# EAGLE schematic Schematic_v29 (EAGLE 9.7.0)
AUTHOR: Luca Brenner; GIT: github.com/BrennerLu/Milwaukee-2-CigLighter
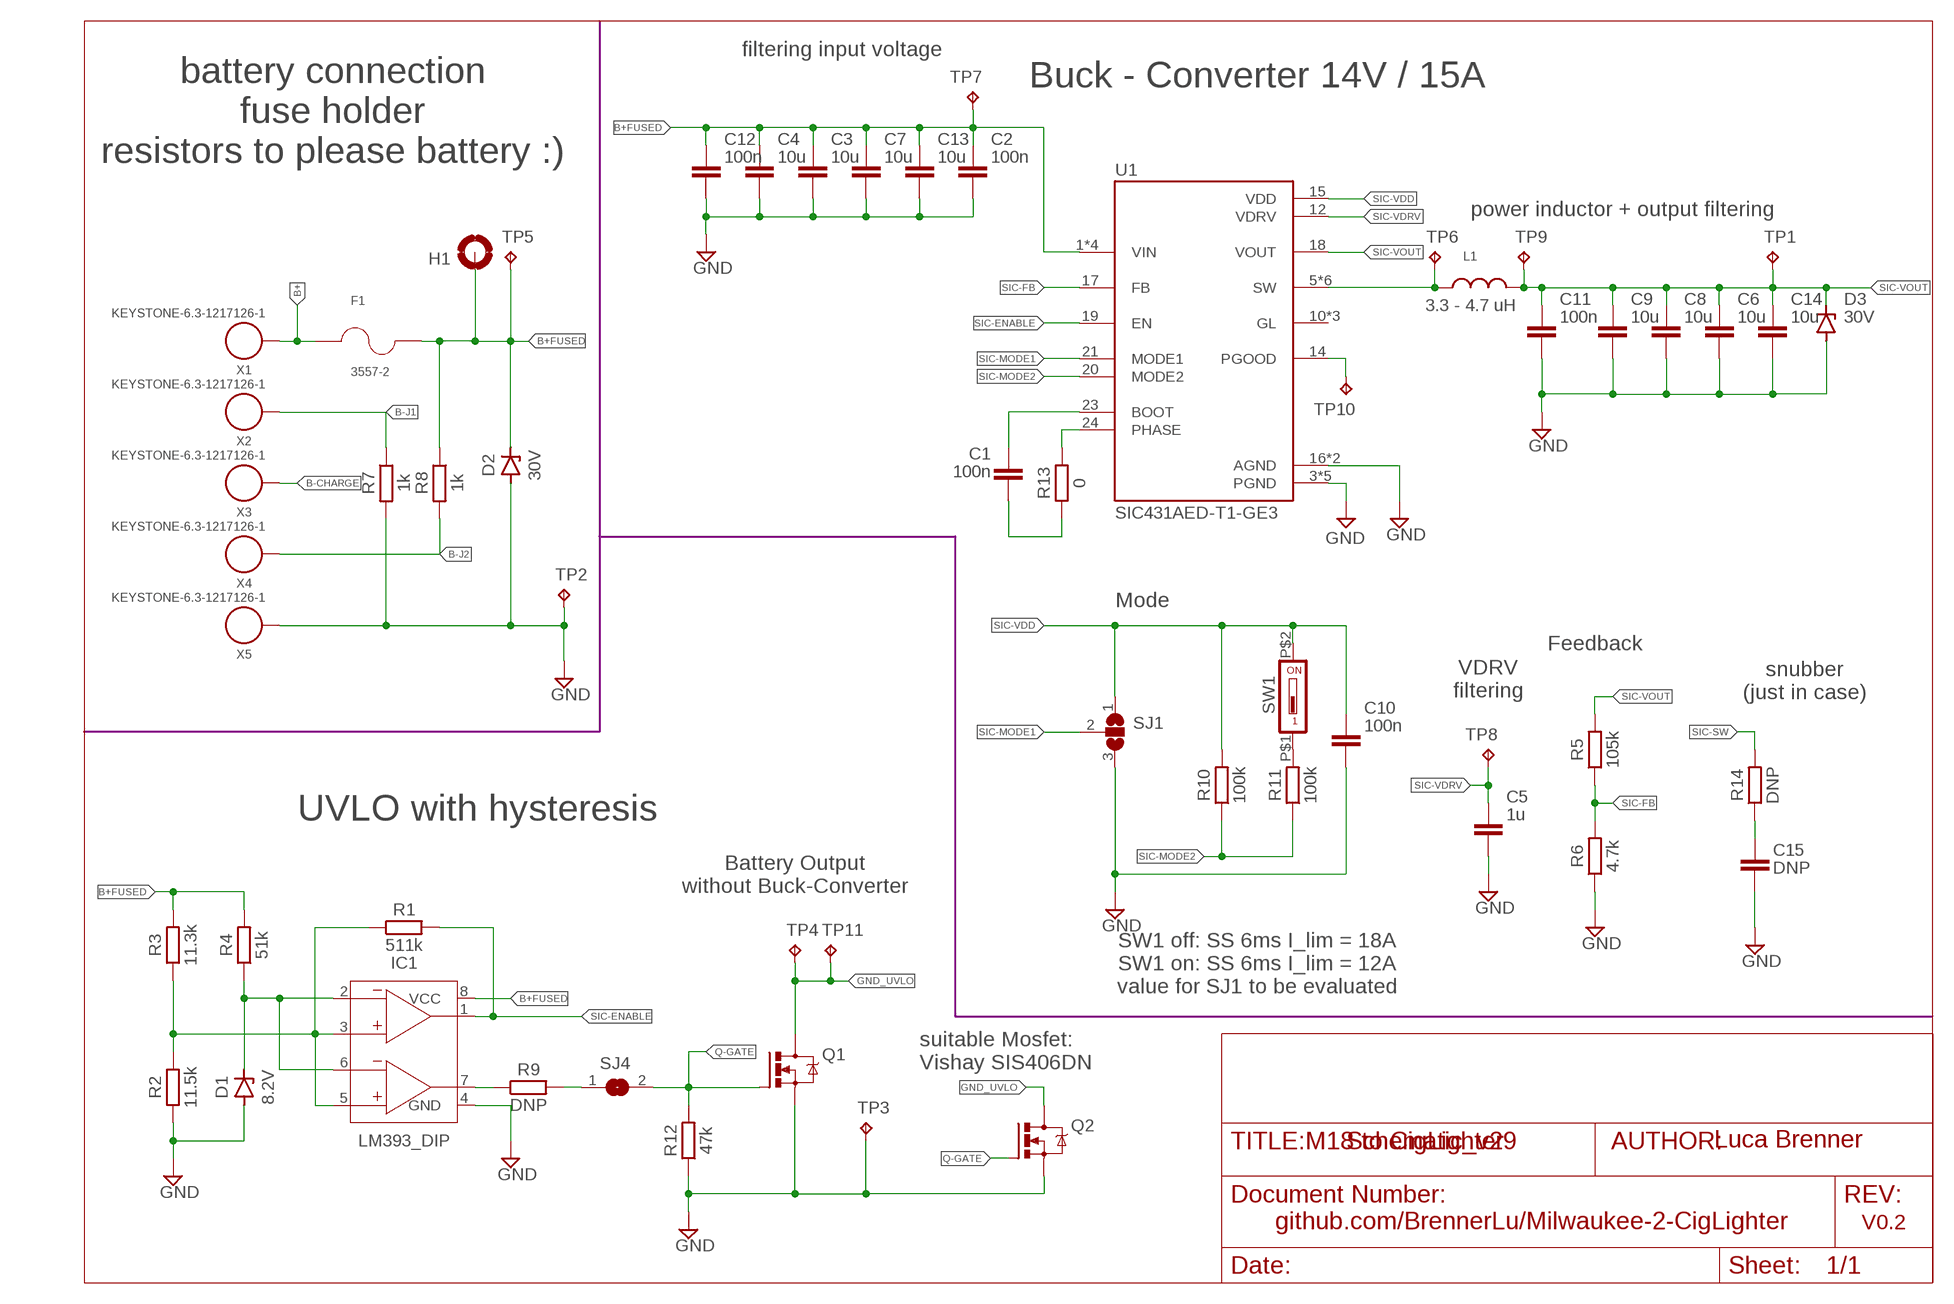
[diagram p0: schematic, sheet 1]

## Parts
C1  100n  C_CHIP-0603(1608-METRIC)  [CAPC1608X85]
C2  100n  C_CHIP-0603(1608-METRIC)  [CAPC1608X85]
C3  10u  C_CHIP-1210(3225-METRIC)  [CAPC3225X135]
C4  10u  C_CHIP-1210(3225-METRIC)  [CAPC3225X135]
C5  1u  C_CHIP-1206(3216-METRIC)  [CAPC3216X135]
C6  10u  C_CHIP-1210(3225-METRIC)  [CAPC3225X135]
C7  10u  C_CHIP-1210(3225-METRIC)  [CAPC3225X135]
C8  10u  C_CHIP-1210(3225-METRIC)  [CAPC3225X135]
C9  10u  C_CHIP-1210(3225-METRIC)  [CAPC3225X135]
C10  100n  C_CHIP-0603(1608-METRIC)  [CAPC1608X85]
C11  100n  C_CHIP-0603(1608-METRIC)  [CAPC1608X85]
C12  100n  C_CHIP-0603(1608-METRIC)  [CAPC1608X85]
C13  10u  C_CHIP-1210(3225-METRIC)  [CAPC3225X135]
C14  10u  C_CHIP-1210(3225-METRIC)  [CAPC3225X135]
C15  DNP  C_CHIP-0603(1608-METRIC)  [CAPC1608X85]
D1  8.2V  ZENER_TZM5231BDO-213AA(SOD-80)  [DIOMELF3516]
D2  30V  ZENERDO-214AA(SMB)  [DIOM5336X265N]
D3  30V  ZENERDO-214AA(SMB)  [DIOM5336X265N]
F1  3557-2  [FUSE_3557-2]
H1  MOUNT-PAD-ROUND2.8  [2,8-PAD]
IC1  LM393_DIP  [DIP826W53P254L959H508Q8B]
L1  3.3 - 4.7 uH  AMDLA1707S-3R3MT  [AMDLA1707S-3R3MT-FP]
Q1  VISHAY-SIS406DN  [POWERPAK-1212-8-SINGLE]
Q2  VISHAY-SIS406DN  [POWERPAK-1212-8-SINGLE]
R1  511k  R_CHIP-0805(2012-METRIC)  [RESC2012X65]
R2  11.5k  R_CHIP-0805(2012-METRIC)  [RESC2012X65]
R3  11.3k  R_CHIP-0805(2012-METRIC)  [RESC2012X65]
R4  51k  R_CHIP-0805(2012-METRIC)  [RESC2012X65]
R5  105k  R_CHIP-0805(2012-METRIC)  [RESC2012X65]
R6  4.7k  R_CHIP-0805(2012-METRIC)  [RESC2012X65]
R7  1k  R_CHIP-0805(2012-METRIC)  [RESC2012X65]
R8  1k  R_CHIP-0805(2012-METRIC)  [RESC2012X65]
R9  DNP  R_CHIP-0805(2012-METRIC)  [RESC2012X65]
R10  100k  R_CHIP-0805(2012-METRIC)  [RESC2012X65]
R11  100k  R_CHIP-0805(2012-METRIC)  [RESC2012X65]
R12  47k  R_CHIP-0805(2012-METRIC)  [RESC2012X65]
R13  0  R_CHIP-0603(1608-METRIC)  [RESC1608X60]
R14  DNP  R_CHIP-0603(1608-METRIC)  [RESC1608X60]
SJ1  SJ2WW  [SJ_2W]
SJ4  SJ  [SJ]
SW1  DS04-254-SMT  [DIPSW-SMD-254]
TP1  TPPAD1-20  [P1-20]
TP2  TPPAD1-20  [P1-20]
TP3  TPPAD1-20  [P1-20]
TP4  TPPAD1-20  [P1-20]
TP5  TPPAD1-20  [P1-20]
TP6  TPB1,27  [B1,27]
TP7  TPB1,27  [B1,27]
TP8  TPB1,27  [B1,27]
TP9  TPB1,27  [B1,27]
TP10  TPTP06R  [TP06R]
TP11  TPPAD1-20  [P1-20]
U1  SIC431AED-T1-GE3  [REGULATOR_SIC431AED-T1-GE3]
X1  KEYSTONE-6.3-1217126-1  [KEYSTONE.6.3-1217126-1-FP]
X2  KEYSTONE-6.3-1217126-1  [KEYSTONE.6.3-1217126-1-FP]
X3  KEYSTONE-6.3-1217126-1  [KEYSTONE.6.3-1217126-1-FP]
X4  KEYSTONE-6.3-1217126-1  [KEYSTONE.6.3-1217126-1-FP]
X5  KEYSTONE-6.3-1217126-1  [KEYSTONE.6.3-1217126-1-FP]

## Nets
B+: F1.1_1 F1.1_2 X1.P$1 X1.P$2
B+FUSED: C2.1 C3.1 C4.1 C7.1 C12.1 C13.1 D2.1(C) F1.2_1 F1.2_2 H1.B2,8(MOUNT) IC1.8(VCC) R3.2 R4.2 R8.1 TP5.TP TP7.TP U1.1(VIN) U1.2(VIN) U1.22(VIN) U1.26(VIN)
B-CHARGE: X3.P$1 X3.P$2
B-J1: R7.1 X2.P$1 X2.P$2
B-J2: R8.2 X4.P$1 X4.P$2
GND: C2.2 C3.2 C4.2 C5.2 C6.2 C7.2 C8.2 C9.2 C10.2 C11.2 C12.2 C13.2 C14.2 C15.1 D1.2(A) D2.2(A) D3.2(A) IC1.4(GND) Q1.S1(S) Q1.S2(S) Q1.S3(S) Q2.S1(S) Q2.S2(S) Q2.S3(S) R2.1 R6.1 R7.2 R12.1 SJ1.3 TP2.TP TP3.TP U1.3(PGND) U1.4(PGND) U1.13(PGND) U1.16(AGND) U1.25(AGND) U1.27_1(PGND) U1.27_2(PGND) X5.P$1 X5.P$2
GND_UVLO: Q1.D1(D) Q1.D2(D) Q1.D3(D) Q1.D4(D) Q1.D-PAD(D) Q2.D1(D) Q2.D2(D) Q2.D3(D) Q2.D4(D) Q2.D-PAD(D) TP4.TP TP11.TP
N$1: R11.2 SW1.P$1
N$2: D1.1(C) IC1.2(-IN1) IC1.6(-IN2) R4.1
N$3: IC1.3(+IN1) IC1.5(+IN2) R1.1 R2.2 R3.1
N$4: IC1.7(OUT2) R9.1
N$5: R9.2 SJ4.1
N$6: TP10.TP U1.14(PGOOD)
N$8: R13.2 U1.24(PHASE)
N$9: C15.2 R14.1
Q-GATE: Q1.G Q2.G R12.2 SJ4.2
SIC-BOOT: C1.2 U1.23(BOOT)
SIC-ENABLE: IC1.1(OUT1) R1.2 U1.19(EN)
SIC-FB: R5.1 R6.2 U1.17(FB)
SIC-MODE1: SJ1.2 U1.21(MODE1)
SIC-MODE2: R10.1 R11.1 U1.20(MODE2)
SIC-PHASE: C1.1 R13.1
SIC-SW: L1.P$1 R14.2 TP6.TP U1.5(SW) U1.6(SW) U1.7(SW) U1.8(SW) U1.9(SW) U1.9.1(SW)
SIC-VDD: C10.1 R10.2 SJ1.1 SW1.P$2 U1.15(VDD)
SIC-VDRV: C5.1 TP8.TP U1.12(VDRV)
SIC-VOUT: C6.1 C8.1 C9.1 C11.1 C14.1 D3.1(C) L1.P$2 R5.2 TP1.TP TP9.TP U1.18(VOUT)
Unconnected: U1.10(GL) U1.11(GL) U1.28(GL)

## Notes on the sheet
- filtering input voltage
- Buck - Converter 14V / 15A
- battery connection
  fuse holder
  resistors to please battery :)
- power inductor + output filtering
- Mode
- Feedback
- VDRV
  filtering
- snubber
  (just in case)
- UVLO with hysteresis
- Battery Output
  without Buck-Converter
- SW1 off: SS 6ms I_lim = 18A
  SW1 on: SS 6ms I_lim = 12A
  value for SJ1 to be evaluated
- suitable Mosfet:
  Vishay SIS406DN
- M18 to CigLighter | AUTHOR:
- V0.2

## Library data of the parts
C1-C15 = Capacitor:C: Capacitor - Generic; CATEGORY: Capacitor
D1 = Diode:ZENER_: Zener Diode - Popular parts; CATEGORY: Diode; DESCRIPTION: DIODE ZENER 5.1V 500MW SOD80; MANUFACTURER: Vishay Semiconductor Diodes Division; MPN: TZM5231B-GS08; SUB-CATEGORY: Zener; THERMALLOSS: 0.5W; VALUE: TZM5231
D2 D3 = Diode:ZENER: Zener Diode - Generic; CATEGORY: Diode; SUB-CATEGORY: Zener; VALUE: ZENER
F1 = SnapEDA Library:3557-2; MANUFACTURER: Keystone; MAXIMUM_PACKAGE_HEIGHT: 7.37mm; PARTREV: D; SNAPEDA_PN: 3557-2; STANDARD: Manufacturer Recommendation
H1 = holes:MOUNT-PAD-ROUND: MOUNTING PAD, round
IC1 = IC_Linear:LM393: Dual Comparators Reference Datasheet <https://www.ti.com/lit/ds/symlink/lm393-n.pdf?ts=1637561071595&ref_url=https%253A%252F%252Fwww.google.com%252F>; CATEGORY: IC_Linear; DESCRIPTION: Differential Dual Comparator; MANUFACTURER: Generic; MPN: Generic; SERIES: LM393; SUB-CATEGORY: Comparator; TYPE: Dual
L1 = m18-to-carjack_lib:AMDLA1707S-3R3MT
Q1 Q2 = m18-to-carjack_lib:VISHAY-SIS406DN
R1-R14 = Resistor:R: Resistor Fixed - Generic; CATEGORY: Resistor; SUB-CATEGORY: Fixed
SJ1 = jumper:SJ2W: SMD solder JUMPER
SJ4 = jumper:SJ: SMD solder JUMPER
SW1 = m18-to-carjack_lib:DS04-254-SMT
TP1-TP11 = testpad:TP: Test pad
U1 = SnapEDA Library:SIC431AED-T1-GE3: Synchronous Buck Regulator Ultrasonic Adjustable 0.6V to 21.6V 24A O/P 24-Pin PowerPAK MLP44 T/R; AVAILABILITY: Good; DESCRIPTION: Synchronous Buck Regulator Ultrasonic Adjustable 0.6V to 21.6V 24A O/P 24-Pin PowerPAK MLP44 T/R; MF: Vishay Siliconix; MP: SIC431AED-T1-GE3; PACKAGE: PowerWFQFN-24 Vishay; PRICE: 1.86 USD
X1-X5 = m18-to-carjack_lib:KEYSTONE-6.3-1217126-1